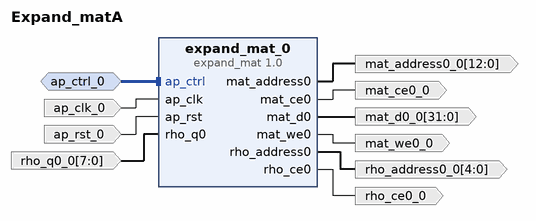
[diagram p0: block diagram of the top level]
# Vivado block design Expand_matA, xc7a35tcpg236-1, Vivado 2022.1
create_bd_design Expand_matA

create_bd_intf_port -mode Slave -vlnv xilinx.com:interface:acc_handshake_rtl:1.0 ap_ctrl_0
create_bd_port -dir I -type clk ap_clk_0
create_bd_port -dir I -type rst ap_rst_0
set_property -dict {CONFIG.POLARITY ACTIVE_HIGH} [get_bd_ports ap_rst_0]
create_bd_port -dir O -from 12 -to 0 -type data mat_address0_0
create_bd_port -dir O mat_ce0_0
create_bd_port -dir O -from 31 -to 0 -type data mat_d0_0
create_bd_port -dir O mat_we0_0
create_bd_port -dir O -from 4 -to 0 -type data rho_address0_0
create_bd_port -dir O rho_ce0_0
create_bd_port -dir I -from 7 -to 0 -type data rho_q0_0

create_bd_cell -type ip -vlnv xilinx.com:hls:expand_mat:1.0 expand_mat_0

# ---- connections ----

connect_bd_intf_net -intf_net ap_ctrl_0_1 [get_bd_intf_ports ap_ctrl_0] [get_bd_intf_pins expand_mat_0/ap_ctrl]
connect_bd_net -net ap_clk_0_1 [get_bd_ports ap_clk_0] [get_bd_pins expand_mat_0/ap_clk]
connect_bd_net -net ap_rst_0_1 [get_bd_ports ap_rst_0] [get_bd_pins expand_mat_0/ap_rst]
connect_bd_net [get_bd_pins expand_mat_0/mat_address0] [get_bd_ports mat_address0_0]
connect_bd_net [get_bd_pins expand_mat_0/mat_ce0] [get_bd_ports mat_ce0_0]
connect_bd_net [get_bd_pins expand_mat_0/mat_d0] [get_bd_ports mat_d0_0]
connect_bd_net [get_bd_pins expand_mat_0/mat_we0] [get_bd_ports mat_we0_0]
connect_bd_net [get_bd_pins expand_mat_0/rho_address0] [get_bd_ports rho_address0_0]
connect_bd_net [get_bd_pins expand_mat_0/rho_ce0] [get_bd_ports rho_ce0_0]
connect_bd_net -net rho_q0_0_1 [get_bd_ports rho_q0_0] [get_bd_pins expand_mat_0/rho_q0]

validate_bd_design
save_bd_design
